# EAGLE design sd2iec_sd_long (EAGLE 8.6.0)
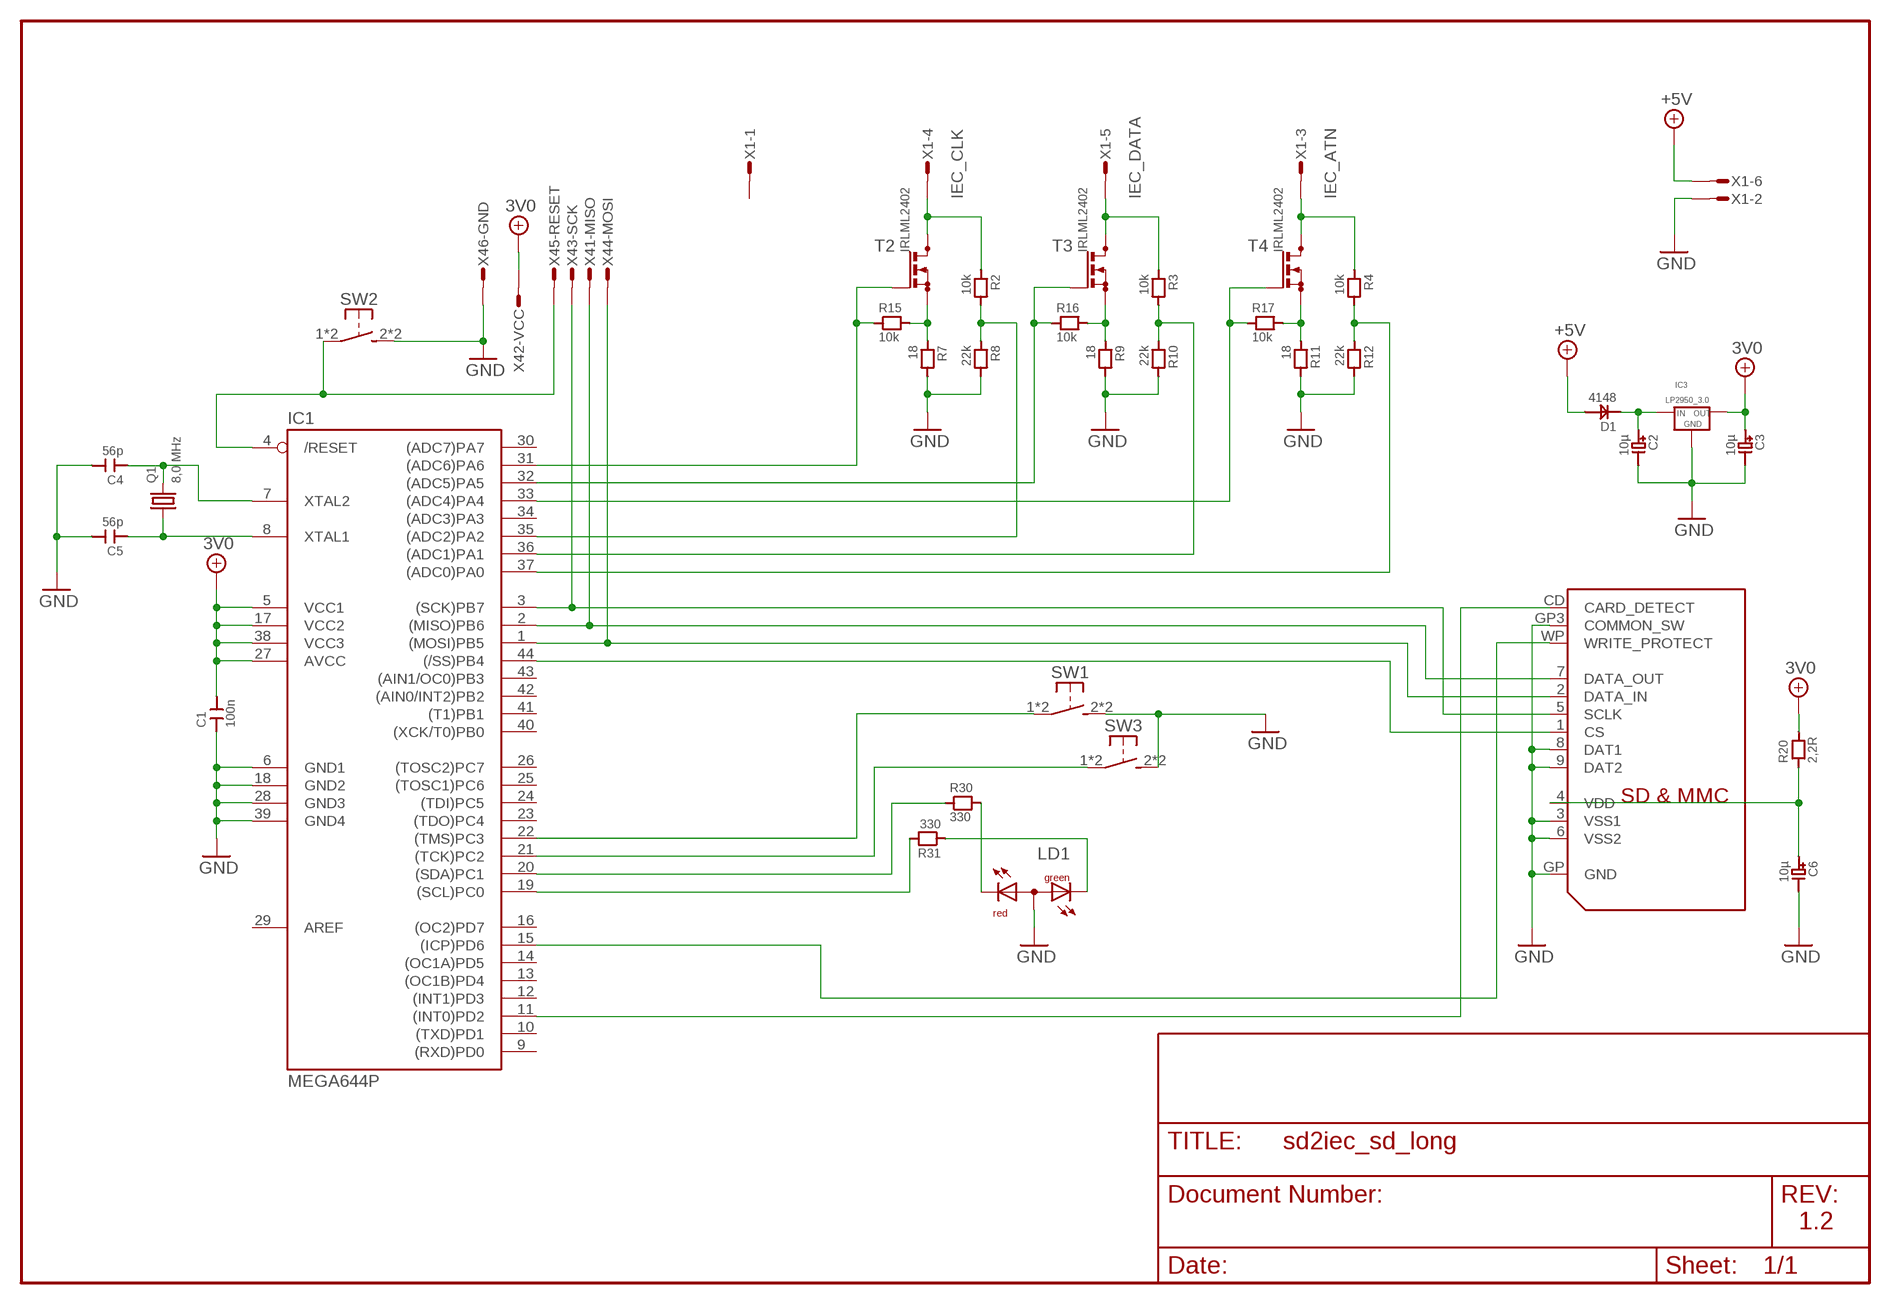
[diagram p0: schematic, sheet 1]

## Parts
C1  100n  C1206  [C1206]
C2  10µ  C_POLTA_A  [C_TANTAL_A]
C3  10µ  C_POLTA_A  [C_TANTAL_A]
C4  56p  C1206  [C1206]
C5  56p  C1206  [C1206]
C6  10µ  C_POLTA_A  [C_TANTAL_A]
D1  4148  DSOD-123  [SOD-123]
IC1  MEGA644P  MEGA16/32TQFP  [TQFP44]
IC3  LP2950_3.0  LP2950_TO92S  [TO92_S]
LD1  DUOLED-RG-A  [DUOLED-A-5MM]
Q1  8,0 MHz  HC49  [HC49/S]
R2  10k  R1206  [R1206]
R3  10k  R1206  [R1206]
R4  10k  R1206  [R1206]
R7  18  R1206  [R1206]
R8  22k  R1206  [R1206]
R9  18  R1206  [R1206]
R10  22k  R1206  [R1206]
R11  18  R1206  [R1206]
R12  22k  R1206  [R1206]
R15  10k  R0805  [R0805]
R16  10k  R0805  [R0805]
R17  10k  R0805  [R0805]
R20  2,2R  R1206  [R1206]
R30  330  R1206  [R1206]
R31  330  R1206  [R1206]
SW1  Disk Next  SW-TACTILE-TL3305  [TL3305]
SW2  Reset  SW-TACTILE-TL3305  [TL3305]
SW3  Disk Prev  SW-TACTILE-TL3305  [TL3305]
T2  IRLML2402  BSN20_C  [SOT23_C]
T3  IRLML2402  BSN20_C  [SOT23_C]
T4  IRLML2402  BSN20_C  [SOT23_C]
U$6  SDMMC06132  [06132]
X1  MICROMATCH-6_PIN  [MICROMATCH-6]
X4  AVR-ISP_1X6  [1X6_ISP]

## Nets
3V0: C1.2 C3.1 IC1.5(VCC1) IC1.17(VCC2) IC1.27(AVCC) IC1.38(VCC3) IC3.3(OUT) R20.2 X4.2
+5V: D1.2 X1.6
/RESET: IC1.4(/RESET) SW2.1 SW2.4(P1) X4.5
ATN: IC1.37((ADC0)PA0) R4.2 R12.1
CD: IC1.11((INT0)PD2) U$6.CD(CARD_DETECT)
CLK: IC1.35((ADC2)PA2) R2.2 R8.1
CS: IC1.44((/SS)PB4) U$6.1(CS)
DATA: IC1.36((ADC1)PA1) R3.2 R10.1
DISKNEXT: IC1.22((TMS)PC3) SW1.1 SW1.4(P1)
DISKPREV: IC1.21((TCK)PC2) SW3.1 SW3.4(P1)
GND: C1.1 C2.2 C3.2 C4.2 C5.2 C6.2 IC1.6(GND1) IC1.18(GND2) IC1.28(GND3) IC1.39(GND4) IC3.2(GND) LD1.A R7.2 R8.2 R9.2 R10.2 R11.2 R12.2 SW1.2(S1) SW1.3(S1) SW2.2(S1) SW2.3(S1) SW3.2(S1) SW3.3(S1) U$6.3(VSS1) U$6.6(VSS2) U$6.8(DAT1) U$6.9(DAT2) U$6.GP3(COMMON_SW) U$6.GP(GND) X1.2 X4.6
IEC_ATN: R4.1 T4.3(D) X1.3
IEC_CLK: R2.1 T2.3(D) X1.4
IEC_DATA: R3.1 T3.3(D) X1.5
LED1: LD1.CR R30.2
LED2: LD1.CX(CG) R31.1
MISO: IC1.2((MISO)PB6) U$6.7(DATA_OUT) X4.1
MOSI: IC1.1((MOSI)PB5) U$6.2(DATA_IN) X4.4
N$2: C2.1 D1.1 IC3.1(IN)
N$4: C5.1 IC1.8(XTAL1) Q1.1
N$5: C4.1 IC1.7(XTAL2) Q1.2
N$17: IC1.32((ADC5)PA5) R16.1 T3.1(G)
N$19: IC1.33((ADC4)PA4) R17.1 T4.1(G)
N$20: IC1.31((ADC6)PA6) R15.1 T2.1(G)
N$23: R7.1 R15.2 T2.2(S)
N$24: R9.1 R16.2 T3.2(S)
N$25: R11.1 R17.2 T4.2(S)
PC0: IC1.19((SCL)PC0) R31.2
PC1: IC1.20((SDA)PC1) R30.1
SCK: IC1.3((SCK)PB7) U$6.5(SCLK) X4.3
VDD: C6.1 R20.1 U$6.4(VDD)
WP: IC1.15((ICP)PD6) U$6.WP(WRITE_PROTECT)
Unconnected: IC1.9((RXD)PD0) IC1.10((TXD)PD1) IC1.12((INT1)PD3) IC1.13((OC1B)PD4) IC1.14((OC1A)PD5) IC1.16((OC2)PD7) IC1.23((TDO)PC4) IC1.24((TDI)PC5) IC1.25((TOSC1)PC6) IC1.26((TOSC2)PC7) IC1.29(AREF) IC1.30((ADC7)PA7) IC1.34((ADC3)PA3) IC1.40((XCK/T0)PB0) IC1.41((T1)PB1) IC1.42((AIN0/INT2)PB2) IC1.43((AIN1/OC0)PB3) X1.1

## Notes on the sheet
- 1.2

## Library data of the parts
C1 C4 C5 = 0_rr:C
C2 C3 C6 = 0_rr:C_POL
D1 = 0_rr:D
IC1 = 0_rr:MEGA16/32: MICROCONTROLLER 16 Kbytes FLASH, 512 bytes EEPROM 1 Kbytes SRAM dual UART hardware multiplier
IC3 = 0_rr:LP2950
LD1 = led:DUOLED-RG-A: DUO LED 2 colors (red/green), 5 mm, round, common Anode www.ligitek.com or other producers.
Q1 = 0_rr:HC49
R2-R4 R7-R12 R15-R17 R20 R30 R31 = 0_rr:R
SW1-SW3 = we-switch:SW-TACTILE: Tactile Switches
T2-T4 = 0_rr:BSN20: N-CHANNEL MOS FET
U$6 = adafruit:SDMMC: SD MMC Card holder 4UCON part #06132 - easy to solder
X1 = 0_rr:MICROMATCH-6: MicroMaTch 6 7-215464-6 / 0-215464-6 Drawing Number C-215464 DDEController.pdf
X4 = 0_rr:AVR-ISP: MicroMaTch 6 7-215464-6 / 0-215464-6 Drawing Number C-215464 DDEController.pdf

## Board
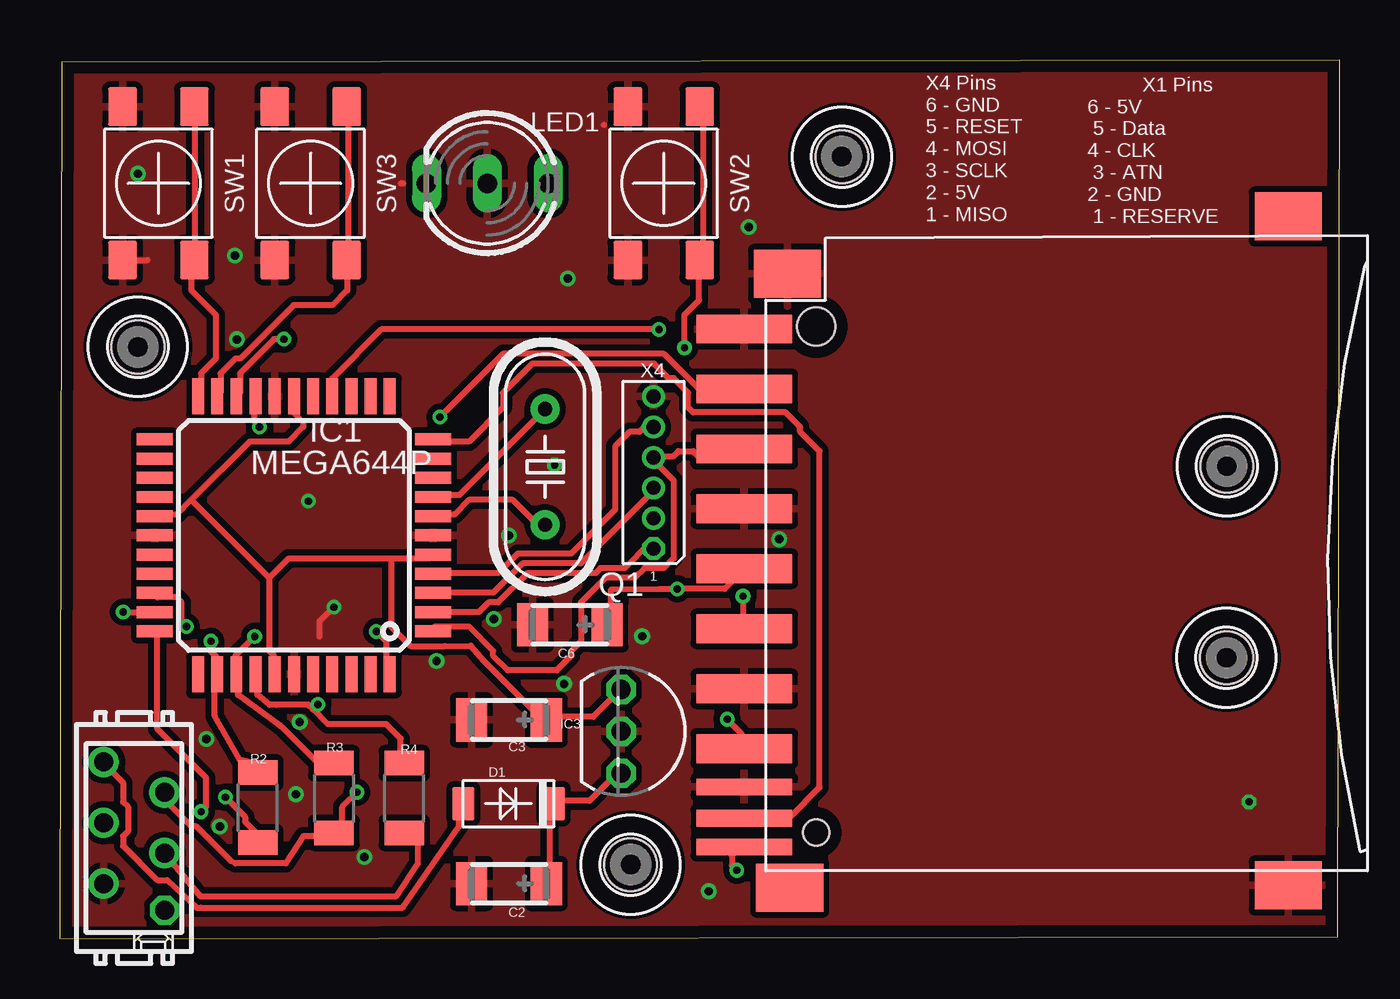
[diagram p1: board, top side]
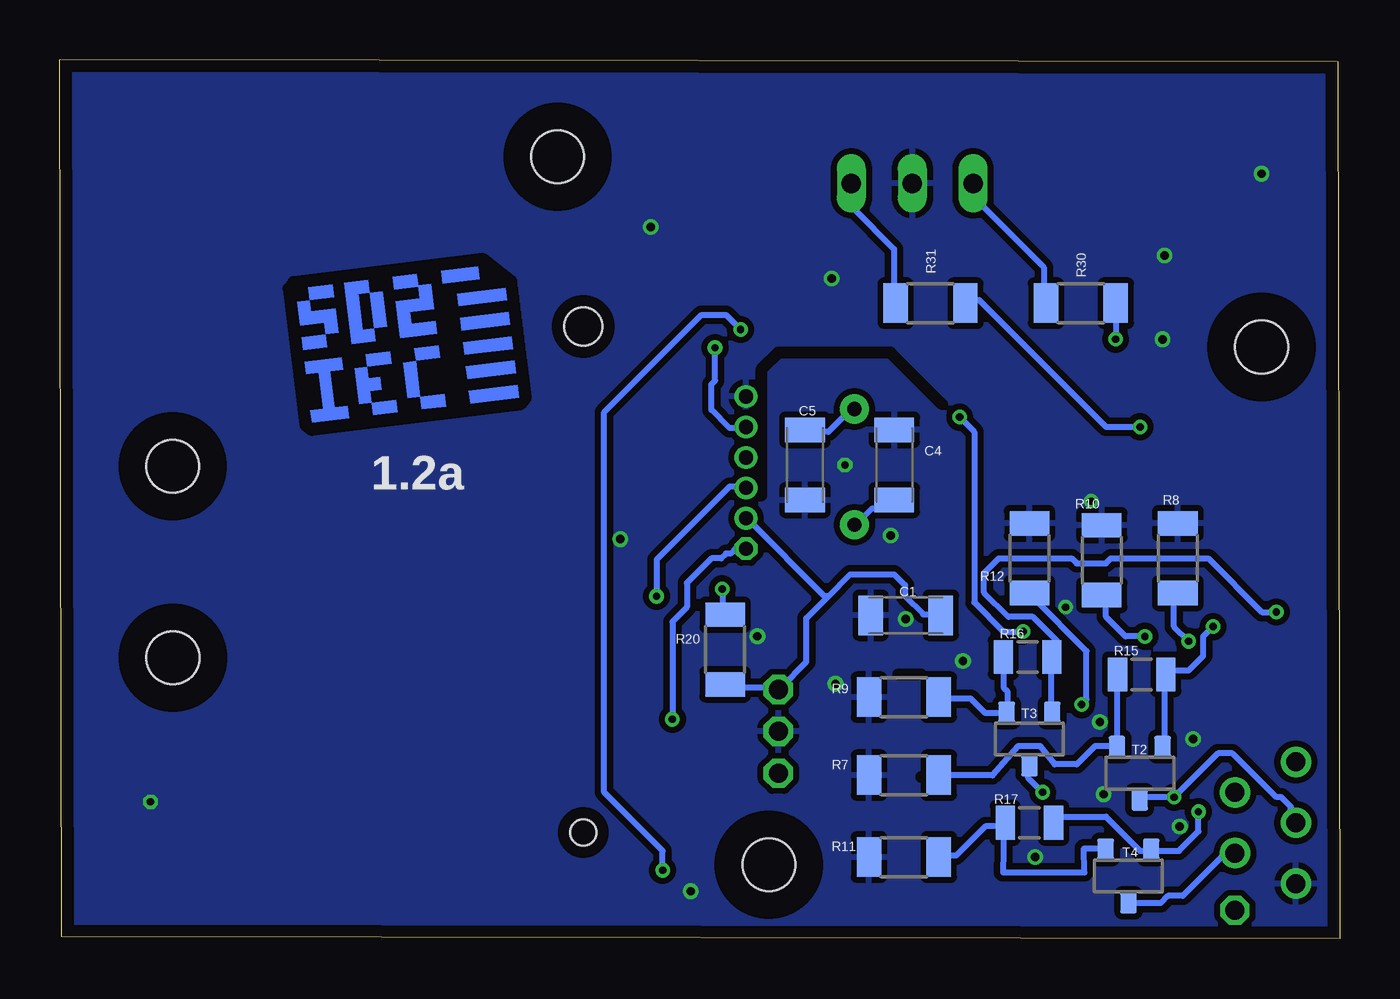
[diagram p2: board, bottom side, seen from below]

Size 53.39 x 36.66 mm. Coordinates in mm from the lower left corner, seen from the top.
Outline: 0,0 53.31,0.08 53.39,36.65 0.08,36.58 0,0
Copper layers (1*16): Top 0.035mm / dielectric 1.6mm / Bottom 0.035mm
Design rules "Elecrow_2-layer_PCB_eagle_rule *": minimum track width 10mil, minimum drill 12mil, track to track 6mil, track to pad 8mil, pad to pad 12mil, via to via 12mil, smd to smd 0mil, copper to edge 20mil, drill to drill 10mil, minimum pad ring 6mil, minimum via ring 6mil, stop-mask expansion 0mil, vias tented up to drill 100mil, thermal gap 10mil
tRestrict: 1 lines
bRestrict: 6 lines

### Footprints (pad centres in the part's own frame; a part is rotated, then mirrored left to right if it is on the bottom)
C1206 = smd 1.016 x 1.651: 1 -1.462,0; 2 1.462,0
C_TANTAL_A = smd 1.3 x 1.8: 1 1.559,0; 2 -1.559,0
SOD-123 = smd 0.914 x 1.397: 1 -1.884,0; 2 1.884,0
TQFP44 = smd 1.5 x 0.5: 1 -5.8,4; 2 -5.8,3.2; 3 -5.8,2.4; 4 -5.8,1.6; 5 -5.8,0.8; 6 -5.8,0; 7 -5.8,-0.8; 8 -5.8,-1.6; 9 -5.8,-2.4; 10 -5.8,-3.2; 11 -5.8,-4; 23 5.8,-4; 24 5.8,-3.2; 25 5.8,-2.4; 26 5.8,-1.6; 27 5.8,-0.8; 28 5.8,0; 29 5.8,0.8; 30 5.8,1.6; 31 5.8,2.4; 32 5.8,3.2; 33 5.8,4 | smd 0.5 x 1.5: 12 -4,-5.8; 13 -3.2,-5.8; 14 -2.4,-5.8; 15 -1.6,-5.8; 16 -0.8,-5.8; 17 0,-5.8; 18 0.8,-5.8; 19 1.6,-5.8; 20 2.4,-5.8; 21 3.2,-5.8; 22 4,-5.8; 34 4,5.8; 35 3.2,5.8; 36 2.4,5.8; 37 1.6,5.8; 38 0.8,5.8; 39 0,5.8; 40 -0.8,5.8; 41 -1.6,5.8; 42 -2.4,5.8; 43 -3.2,5.8; 44 -4,5.8
TO92_S = drill 0.8 pad 1.219 octagon: 1 1.746,0; 2 0,0; 3 -1.746,0
DUOLED-A-5MM = drill 0.813 long: A 0,0; CR 2.54,0; CX -2.54,0
HC49/S = drill 0.6 pad 1.219: 1 -2.413,0; 2 2.413,0
R1206 = smd 1.016 x 1.651: 1 -1.454,0; 2 1.454,0
R0805 = smd 0.8 x 1.4: 1 -1.009,0; 2 1.009,0
TL3305 = smd 1.6 x 1.2: 1 -3.2,1.5; 2 -3.2,-1.5; 3 3.2,-1.5; 4 3.2,1.5
SOT23_C = smd 0.7 x 0.9: 1 -0.953,-1.111; 2 0.953,-1.111; 3 0,1.111
2,2 = hole 2.2: 0,0
06132 = smd 1.2 x 4: 1 6.9,0.9; 2 4.4,0.9; 3 1.9,0.9; 4 -0.6,0.9; 5 -3.1,0.9; 6 -5.6,0.9; 7 -8.1,0.9; 9 9.4,0.9 | smd 0.7 x 4: 8 -9.7,0.9; CD -11,0.9; WP -12.2,0.9 | smd 2 x 2.8: GP -13.8,-21.8; GP2 14.1,-21.8; GP3 11.7,-0.9; GP4 -13.9,-1 | hole 1.1: -11.6,-2.1 | hole 1.6: 9.5,-2.1
MICROMATCH-6 = drill 0.8 pad 1.118 octagon: 1 3.016,1.27 | drill 0.8 pad 1.27: 2 1.905,-1.27; 3 0.635,1.27; 4 -0.635,-1.27; 5 -1.905,1.27; 6 -3.175,-1.27
1X6_ISP = drill 0.6 pad 0.94 octagon: 1 0,0 | drill 0.6 pad 0.94: 2 1.27,0; 3 2.54,0; 4 3.81,0; 5 5.08,0; 6 6.35,0

### Placement (x,y rotation side)
C1  18.1,13.49 0 bottom
C2  18.73,2.3 0 top
C3  18.73,9.13 0 top
C4  18.57,19.76 90 bottom
C5  22.3,19.76 270 bottom
C6  21.27,13.1 0 top
D1  18.71,5.64 180 top
IC1  9.76,16.83 180 top
IC3  23.42,8.65 270 top
LD1  17.83,31.51 180 top
Q1  20.24,19.69 270 top
R2  8.26,5.48 90 top
R3  11.43,5.87 90 top
R4  14.37,5.87 90 top
R7  18.18,6.83 180 bottom
R8  6.75,15.88 90 bottom
R9  18.18,10.08 180 bottom
R10  9.92,15.8 90 bottom
R11  18.18,3.41 180 bottom
R12  12.94,15.87 90 bottom
R15  8.26,11.03 180 bottom
R16  13.02,11.75 180 bottom
R17  12.94,4.84 180 bottom
R20  25.64,12.07 270 bottom
R30  10.79,26.51 180 bottom
R31  17.07,26.51 0 bottom
SW1  4.11,31.51 270 top
SW2  25.19,31.51 270 top
SW3  10.46,31.51 270 top
T2  8.34,6.91 180 bottom
T3  12.94,8.33 180 bottom
T4  8.81,2.62 180 bottom
U$1  [2,2]  48.68,19.71 0 top
U$2  [2,2]  32.62,32.62 0 top
U$3  [2,2]  48.67,11.72 0 top
U$4  [2,2]  23.81,3.1 0 top
U$5  [SD2IEC_LOGO]  38.97,24.77 7 bottom
U$6  29.45,16.03 90 top
U$7  [2,2]  3.25,24.69 0 top
X1  3.1,4.21 270 top
X4  24.76,16.27 90 top

### Tracks (layer width: path | path; a pad name or v marks a point on that pad's centre or on a via)
3V0
  Top 0.254: IC3.3 23.31,10.33 22.25,9.26 20.42,9.26 C3.1 20.11,9.16 17.68,11.6 17.14,12.23 16.05,12.21 14.63,12.21 13.81,13.02 13.81,15.87 | 5.48,18.3 7.92,20.74 9.55,20.74 10.16,21.35 10.16,21.55 9.75,21.96 9.75,22.57 IC1.17 | 5.48,18.3 4.87,17.69 4.06,17.69 IC1.27 | 8.73,15.05 8.73,12 8.94,11.8 8.94,11.19 IC1.38 | 5.48,18.3 8.73,15.05 | 13.81,15.87 9.55,15.87 8.73,15.05 | 13.81,15.87 15.44,15.87 IC1.5
  Bottom 0.254: 16.64,13.13 C1.2 16.76,13.53 17.37,13.53 18.13,14.29 18.13,14.75 18.59,15.2 20.42,15.2 21.33,14.29 | R20.2 25.6,10.48 24.69,10.48 24.53,10.47 24.38,10.47 24.23,10.48 23.47,10.48 IC3.3 23.31,10.48 22.25,11.55 22.25,13.38 21.33,14.29 | 21.33,14.29 21.49,14.29 24.69,17.49 X4.2
  Bottom 0.305: 25.64,10.48 R20.2
+5V
  Top 0.254: D1.2 16.66,5.5 16.66,4.69 14.3,1.3 5.88,1.3 5.71,1.29 4.47,2.45 4.06,2.45 2.64,3.88 2.64,4.28 2.84,4.49 2.84,5.5 2.64,5.71 2.64,6.52 1.83,7.33 X1.6
/RESET  (via drill 0.3)
  Top 0.254: v26.06,24.65 26.06,26.03 26.67,26.63 26.67,28.31 SW2.4 26.82,28.46 26.82,34.56 SW2.1 | IC1.4 15.64,15.26 18.28,15.26 19.1,16.07 21.33,16.07 23.16,17.9 23.16,20.54 23.77,21.15 24.18,21.15 24.58,21.55 24.79,21.35 X4.5
  Bottom 0.254: v26.06,24.65 26.06,23.28 26.21,23.13 26.21,22.06 25.45,21.3 24.84,21.3 X4.5
ATN  (via drill 0.3)
  Top 0.254: 10.56,9.57 11.17,8.96 13.61,8.96 14.22,8.35 14.22,7.33 R4.2 | 10.56,9.57 10.36,9.77 9.75,9.77 9.03,9.76 8.74,9.76 8.25,10.18 8.25,10.91 IC1.37 | 10.56,9.57 v10.77,9.77
  Bottom 0.254: v10.77,9.77 10.56,9.97 10.56,12 12.8,14.24 R12.1
CD
  Top 0.254: IC1.11 15.64,20.74 17.07,20.74 18.49,22.16 18.49,22.77 19.71,23.99 24.79,23.99 25.4,23.38 25.6,23.38 26.21,22.77 26.21,22.16 26.41,21.96 30.27,21.96 30.88,21.35 30.88,21.15 31.7,20.34 31.7,6.31 30.48,5.1 28.65,5.1 U$6.CD
CLK  (via drill 0.3)
  Top 0.254: R2.2 8.12,7.33 7.49,7.47 6.46,9.29 6.46,10.99 IC1.35 6.5,11.19 6.5,11.8 6.3,12 v6.3,12.41
  Bottom 0.254: v6.3,12.41 6.91,13.02 6.91,14.24 R8.1
CS  (via drill 0.3)
  Top 0.254: v13.2,12.82 13.61,12.41 13.61,11.19 IC1.44 | v15.85,21.76 18.49,24.4 25.19,24.4 26.62,22.98 28.44,22.98 U$6.1
  Bottom 0.254: v13.2,12.82 14.02,12.82 15.24,14.04 15.24,21.15 v15.85,21.76
DATA  (via drill 0.3)
  Top 0.254: R3.2 11.38,7.33 10.77,7.33 9.34,8.75 9.18,8.91 7.44,10.18 7.36,10.99 IC1.36 7.31,11.19 7.31,11.8 v8.12,12.61
  Bottom 0.254: v8.12,12.61 8.94,12.61 9.75,13.43 9.75,14.24 R10.1
DISKNEXT
  Top 0.254: SW1.1 5.64,34.56 5.64,28.46 SW1.4 5.48,28.26 5.48,27.04 6.5,26.03 6.5,24.2 5.89,23.59 5.89,22.77 IC1.22
DISKPREV
  Top 0.254: SW3.1 12.04,34.56 12.04,28.46 SW3.4 11.99,28.26 11.99,27.04 11.38,26.43 9.75,26.43 7.52,24.2 7.31,24.2 6.7,23.59 6.7,22.77 IC1.21
GND  (via drill 0.3, 0.35)
  Top 0.254: 10.82,12.61 10.82,13.22 v11.43,13.83 | 3.65,28.31 2.74,28.31 SW1.3 | 14.32,31.51 14.22,31.51 | 22.7,33.95 22.69,33.95
  other vias: 20.64,19.76 49.61,5.71 10.36,18.25 18.1,13.33 30,16.67 28.73,29.69 6.67,4.68 15.72,11.59 21.03,10.64 24.29,12.62 7.3,28.5 7.38,25 21.19,27.54 3.25,31.91 18.73,16.83 27.07,1.98 6.11,8.33 10,9.05 12.7,3.41 9.84,6.03
  pour Top (isolate 0.254): -0.08,0.08 0,36.67 53.5,36.51 53.42,0.08
  pour Bottom (isolate 0.254): -0.16,0.16 0,36.75 53.5,36.43 53.5,-0.16
IEC_ATN
  Top 0.254: R4.1 14.94,4.36 14.94,3.15 14.04,1.78 5.85,1.78 4.64,3.23 4.47,3.47 X1.3
  Bottom 0.254: T4.3 8.68,1.49 7.46,1.49 7.16,1.79 6.55,1.79 4.87,3.47 4.42,3.47 X1.3
IEC_CLK  (via drill 0.3)
  Top 0.254: v6.91,5.91 7.72,5.1 7.72,4.89 8.12,4.49 R2.1
  Bottom 0.254: T2.3 8.33,5.91 v6.91,5.91 5.08,7.74 4.47,7.74 2.64,5.91 2.44,5.91 2.03,5.5 2.03,4.89 X1.4
IEC_DATA  (via drill 0.3)
  Top 0.254: v12.39,6.11 11.78,5.5 11.78,4.69 11.58,4.49 R3.1 11.38,4.28 10.16,4.28 9.42,3.15 7.31,3.15 7.14,3.24 6.5,3.88 5.69,4.69 5.48,4.69 4.47,5.71 4.47,5.91 X1.5
  Bottom 0.254: v12.39,6.11 13,6.72 13,7.13 T3.3
LED1
  Bottom 0.254: R30.2 12.34,26.63 12.34,28.01 15.24,30.9 15.24,31.51 LD1.CR
LED2
  Bottom 0.254: R31.1 18.59,26.63 18.59,28.77 20.27,30.44 20.27,31.51 LD1.CX
MISO  (via drill 0.3)
  Top 0.254: IC1.2 15.64,13.63 17.47,13.63 17.88,14.04 18.28,14.04 19.5,15.26 22.35,15.26 22.55,15.46 23.57,15.46 24.58,16.47 24.79,16.27 X4.1 | v27.84,9.16 28.44,8.55 28.44,7.94 U$6.7
  Bottom 0.254: v27.84,9.16 27.84,13.22 27.23,13.83 27.23,14.85 26.21,15.87 25.8,15.87 25.6,16.07 25.4,16.07 25.19,16.27 24.79,16.27 X4.1
MOSI
  Top 0.254: 27.8,20.08 27.78,20.08 27.79,20.09 27.89,20.08 28.19,20.08 28.5,20.39 U$6.2 27.84,20.13 26.62,20.13 26.41,20.34 25.8,20.34 25.6,20.13 24.79,20.13 X4.4 24.58,19.93 24.79,19.73 24.99,19.73 25.6,19.12 25.6,15.87 25.19,15.46 24.38,15.46 23.97,15.05 22.76,15.05 21.74,14.04 21.74,12.41 21.33,12 21.33,11.8 20.72,11.19 18.69,11.19 18.08,11.8 18.08,12 17.07,13.02 15.64,13.02 IC1.1
N$2
  Top 0.254: IC3.1 23.31,6.98 22.09,5.76 20.72,5.76 D1.1 20.57,5.6 20.42,5.45 20.42,2.4 C2.1
N$4
  Top 0.254: IC1.8 15.64,18.51 16.66,18.51 20.11,21.96 Q1.1
  Bottom 0.254: C5.1 22.25,21.15 21.33,21.15 20.27,22.22 Q1.1
N$5
  Top 0.254: IC1.7 15.64,17.69 16.46,17.69 17.07,18.3 18.89,18.3 20.11,17.08 Q1.2
  Bottom 0.254: C4.1 18.59,18.25 19.05,18.25 19.35,17.95 19.5,17.95 20.11,17.34 Q1.2
N$17  (via drill 0.3)
  Top 0.254: v2.64,13.63 3.86,13.63 IC1.32
  Bottom 0.254: T3.1 12.04,9.57 12.04,11.7 R16.1 11.99,11.8 11.78,12 11.78,12.41 12.8,13.43 13.81,13.43 14.83,14.44 14.83,15.26 14.22,15.87 11.17,15.87 10.97,15.66 9.75,15.66 9.55,15.87 5.48,15.87 3.25,13.63 v2.64,13.63
N$19  (via drill 0.3)
  Top 0.254: v5.89,5.3 6.09,5.5 6.09,6.72 4.06,8.75 4.06,12.82 IC1.33
  Bottom 0.254: R17.1 11.99,4.89 11.78,5.1 9.75,5.1 8.33,3.67 7.92,3.67 T4.1 7.72,3.67 6.7,3.67 5.89,4.49 v5.89,5.3
N$20  (via drill 0.3)
  Top 0.254: v5.28,13.02 5.08,13.22 5.08,14.04 4.87,14.24 4.06,14.24 IC1.31
  Bottom 0.254: T2.1 7.31,8.04 7.31,10.79 R15.1 7.31,10.99 7.11,11.19 6.3,11.19 5.69,11.8 5.69,12.61 v5.28,13.02
N$23
  Bottom 0.254: 9.29,8.04 9.29,10.79 R15.2 | 9.29,8.04 10.21,8.04 10.97,7.28 11.88,7.28 12.49,8.04 13.41,8.04 14.47,6.82 16.61,6.82 R7.1 | 9.29,8.04 T2.2
N$24
  Bottom 0.254: R16.2 14.02,11.7 14.02,10.48 13.87,10.33 13.87,9.57 T3.2 14.02,9.41 14.78,9.41 15.39,10.02 16.61,10.02 R9.1
N$25
  Bottom 0.254: 14.02,4.69 14.02,4.84 R17.2 14.02,4.69 | 14.02,4.69 14.02,3.62 14.04,2.77 10.64,2.77 10.66,3.77 9.9,3.77 T4.2 | 14.02,4.69 14.78,4.69 16,3.47 16.61,3.47 R11.1
PC0  (via drill 0.3)
  Top 0.254: v8.33,21.35 8.12,21.55 8.12,22.57 IC1.19
  Bottom 0.254: v8.33,21.35 9.75,21.35 15.03,26.63 15.44,26.63 R31.2
PC1  (via drill 0.3)
  Top 0.254: v9.34,25.01 8.94,25.01 7.52,23.59 7.52,22.77 IC1.20
  Bottom 0.254: v9.34,25.01 9.34,26.43 R30.1
SCK  (via drill 0.3)
  Top 0.254: v28.5,14.29 28.5,13.07 U$6.5 | IC1.3 15.64,14.44 18.08,14.44 19.3,15.66 21.74,15.66 24.58,18.51 24.79,18.51 24.79,18.71 X4.3
  Bottom 0.254: v28.5,14.29 28.5,15.81 25.45,18.86 24.84,18.86 X4.3
VDD  (via drill 0.3)
  Top 0.254: C6.1 23.01,13.22 23,14.57 25,14.6 v25.75,14.6 27.73,14.6 28.5,15.36 U$6.4
  Top 0.305: C6.1 22.94,13.1
  Bottom 0.254: v25.75,14.6 25.75,13.68 R20.1
  Bottom 0.305: 25.63,13.65 R20.1
WP  (via drill 0.3)
  Top 0.254: v24.99,25.42 13.41,25.42 11.38,23.38 11.38,22.77 IC1.15 | v28.24,2.86 28.04,3.06 28.04,3.47 28.44,3.88 U$6.WP
  Bottom 0.254: v24.99,25.42 25.6,26.03 26.62,26.03 30.68,21.96 30.68,6.11 28.24,3.67 v28.24,2.86

### Text on the board
tPlace: LED1 | X4 Pins / 6 - GND / 5 - RESET / 4 - MOSI / 3 - SCLK / 2 - 5V / 1 - MISO | X1 Pins / 6 - 5V / 5 - Data / 4 - CLK / 3 - ATN / 2 - GND / 1 - RESERVE | X4 | IC1 | MEGA644P | 1 | Q1
bPlace: 1.2a